# EAGLE schematic SISTEM MINIMUM ATMEGA16 signal (EAGLE 5.06)
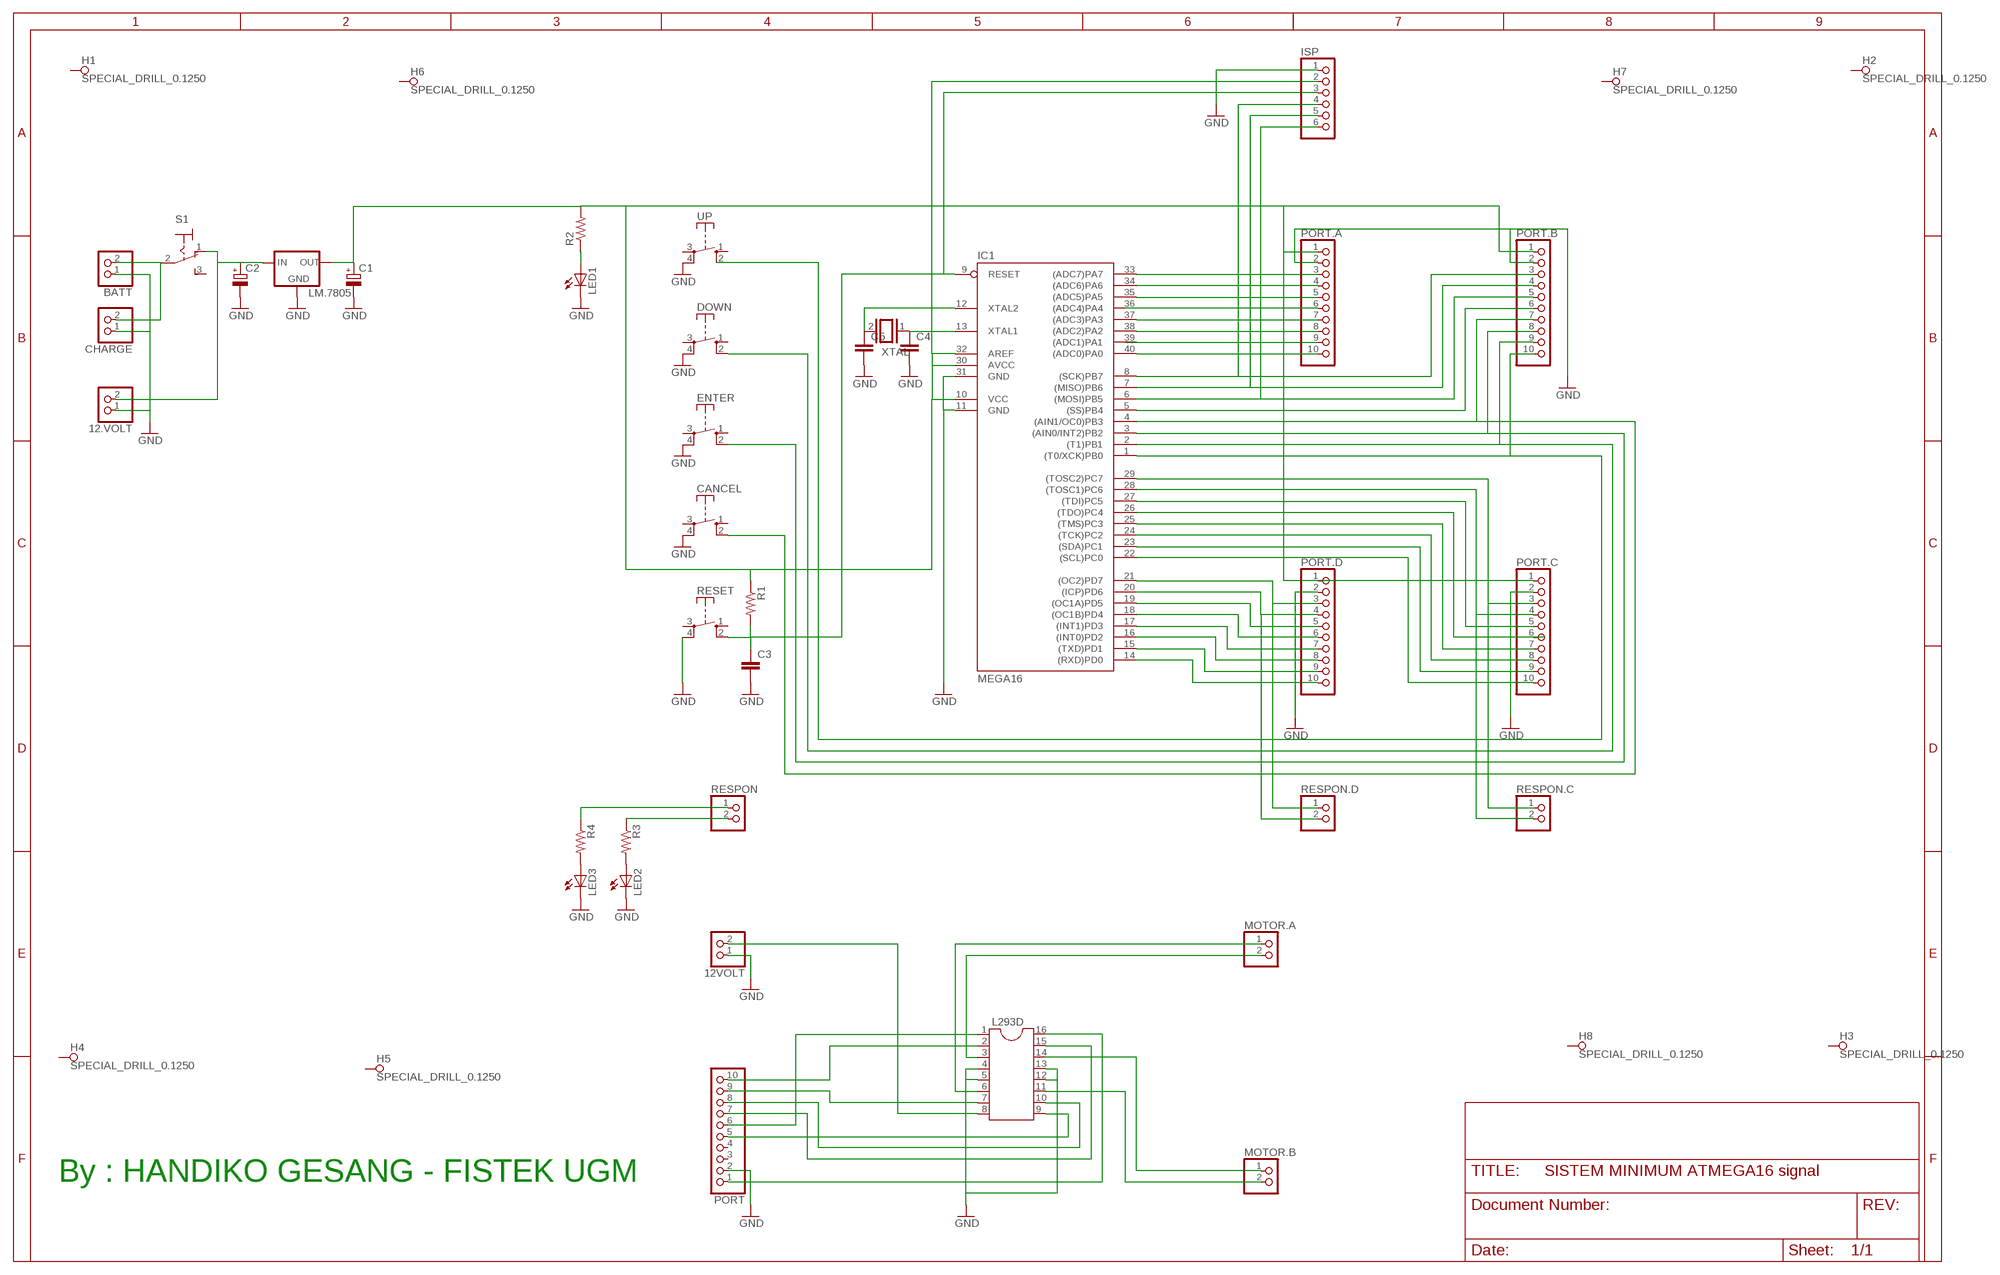
[diagram p0: schematic, sheet 1]

## Parts
12.VOLT  PINHD-1X2  [1X02]
12VOLT  PINHD-1X2  [1X02]
BATT  PINHD-1X2  [1X02]
C1  CPOL-EUB45181B  [B45181B]
C2  CPOL-EUB45181B  [B45181B]
C3  C-EU025-025X050  [C025-025X050]
C4  C-EU025-025X050  [C025-025X050]
C5  C-EU025-025X050  [C025-025X050]
CANCEL  DTE6  [DTE6]
CHARGE  PINHD-1X2  [1X02]
DOWN  DTE6  [DTE6]
ENTER  DTE6  [DTE6]
H1  SPECIAL_DRILL_0.1250  [PAD_0.1250]
H2  SPECIAL_DRILL_0.1250  [PAD_0.1250]
H3  SPECIAL_DRILL_0.1250  [PAD_0.1250]
H4  SPECIAL_DRILL_0.1250  [PAD_0.1250]
H5  SPECIAL_DRILL_0.1250  [PAD_0.1250]
H6  SPECIAL_DRILL_0.1250  [PAD_0.1250]
H7  SPECIAL_DRILL_0.1250  [PAD_0.1250]
H8  SPECIAL_DRILL_0.1250  [PAD_0.1250]
IC1  MEGA16  MEGA16-P  [DIL40]
ISP  PINHD-1X6  [1X06]
L293D  DIL16  [DIL16]
LED1  LED5MM  [LED5MM]
LED2  LED5MM  [LED5MM]
LED3  LED5MM  [LED5MM]
LM.7805  78XXL  [78XXL]
MOTOR.A  PINHD-1X2  [1X02]
MOTOR.B  PINHD-1X2  [1X02]
PORT  PINHD-1X10  [1X10]
PORT.A  PINHD-1X10  [1X10]
PORT.B  PINHD-1X10  [1X10]
PORT.C  PINHD-1X10  [1X10]
PORT.D  PINHD-1X10  [1X10]
R1  R-US_0207/10  [0207/10]
R2  R-US_0207/10  [0207/10]
R3  R-US_0207/10  [0207/10]
R4  R-US_0207/10  [0207/10]
RESET  DTE6  [DTE6]
RESPON  PINHD-1X2  [1X02]
RESPON.C  PINHD-1X2  [1X02]
RESPON.D  PINHD-1X2  [1X02]
S1  320-916  [320-916]
UP  DTE6  [DTE6]
XTAL  XTAL/S  [QS]

## Nets
GND: 12.VOLT.1 12VOLT.1 BATT.1 C1.- C2.- C3.2 C4.2 C5.2 CANCEL.4(P) CHARGE.1 DOWN.4(P) ENTER.4(P) IC1.11(GND) IC1.31(GND) ISP.1 L293D.4 L293D.5 L293D.12 L293D.13 LED1.K(C) LED2.K(C) LED3.K(C) LM.7805.GND PORT.2 PORT.A.2 PORT.B.2 PORT.C.2 PORT.D.2 RESET.4(P) UP.4(P)
N$2: IC1.23((SDA)PC1) PORT.C.9
N$3: 12.VOLT.2 C2.+ LM.7805.IN S1.1(O)
N$4: BATT.2 CHARGE.2 S1.2(P)
N$5: DOWN.2(S) IC1.2((T1)PB1) PORT.B.9
N$6: LED1.A R2.1
N$7: C4.1 IC1.13(XTAL1) XTAL.1
N$8: C5.1 IC1.12(XTAL2) XTAL.2
N$9: C3.1 IC1.9(RESET) ISP.3 R1.2 RESET.2(S)
N$10: IC1.24((TCK)PC2) PORT.C.8
N$11: IC1.22((SCL)PC0) PORT.C.10
N$12: IC1.40((ADC0)PA0) PORT.A.10
N$13: PORT.A.9
N$14: IC1.38((ADC2)PA2) PORT.A.8
N$15: IC1.37((ADC3)PA3) PORT.A.7
N$16: PORT.A.6
N$17: IC1.35((ADC5)PA5) PORT.A.5
N$18: IC1.34((ADC6)PA6) PORT.A.4
N$19: IC1.33((ADC7)PA7) PORT.A.3
N$20: IC1.1((T0/XCK)PB0) PORT.B.10 UP.2(S)
N$21: L293D.6 MOTOR.A.1
N$22: L293D.3 MOTOR.A.2
N$23: L293D.11 MOTOR.B.2
N$24: IC1.5((SS)PB4) PORT.B.6
N$25: IC1.7((MISO)PB6) ISP.5 PORT.B.4
N$26: IC1.8((SCK)PB7) ISP.4 PORT.B.3
N$27: IC1.6((MOSI)PB5) ISP.6 PORT.B.5
N$28: IC1.29((TOSC2)PC7) PORT.C.3 RESPON.C.1
N$29: IC1.28((TOSC1)PC6) PORT.C.4 RESPON.C.2
N$30: IC1.27((TDI)PC5) PORT.C.5
N$31: IC1.26((TDO)PC4) PORT.C.6
N$32: CANCEL.2(S) IC1.4((AIN1/OC0)PB3) PORT.B.7
N$33: IC1.25((TMS)PC3) PORT.C.7
N$34: L293D.14 MOTOR.B.1
N$35: L293D.1 PORT.6
N$36: IC1.21((OC2)PD7) PORT.D.3 RESPON.D.1
N$37: IC1.20((ICP)PD6) PORT.D.4 RESPON.D.2
N$38: IC1.19((OC1A)PD5) PORT.D.5
N$39: IC1.18((OC1B)PD4) PORT.D.6
N$40: IC1.17((INT1)PD3) PORT.D.7
N$41: IC1.16((INT0)PD2) PORT.D.8
N$42: IC1.15((TXD)PD1) PORT.D.9
N$43: IC1.14((RXD)PD0) PORT.D.10
N$44: L293D.9 PORT.5
N$45: ENTER.2(S) IC1.3((AIN0/INT2)PB2) PORT.B.8
N$46: LED2.A R3.2
N$47: L293D.2 PORT.10
N$48: L293D.7 PORT.9
N$49: L293D.10 PORT.8
N$50: L293D.15 PORT.7
N$51: L293D.16 PORT.1
N$52: 12VOLT.2 L293D.8
N$53: LED3.A R4.2
N$54: R3.1 RESPON.2
N$55: R4.1 RESPON.1
UP: C1.+ IC1.10(VCC) IC1.30(AVCC) IC1.32(AREF) ISP.2 LM.7805.OUT PORT.A.1 PORT.B.1 PORT.C.1 PORT.D.1 R1.1 R2.2
Unconnected: CANCEL.1(S) CANCEL.3(P) DOWN.1(S) DOWN.3(P) ENTER.1(S) ENTER.3(P) H1.1 H2.1 H3.1 H4.1 H5.1 H6.1 H7.1 H8.1 IC1.36((ADC4)PA4) IC1.39((ADC1)PA1) PORT.3 PORT.4 RESET.1(S) RESET.3(P) S1.3(S) UP.1(S) UP.3(P)

## Notes on the sheet
- By : HANDIKO GESANG - FISTEK UGM

## Library data of the parts
12.VOLT 12VOLT BATT CHARGE MOTOR.A MOTOR.B RESPON RESPON.C RESPON.D = pinhead:PINHD-1X2: PIN HEADER
C1 C2 = resistor:CPOL-EU: POLARIZED CAPACITOR, European symbol
C3-C5 = resistor:C-EU: CAPACITOR, European symbol
CANCEL DOWN ENTER RESET UP = switch-misc:DT: ITT SWITCH
H1-H8 = special-drill:SPECIAL_DRILL_: Special drills
IC1 = atmel:MEGA16-P: MICROCONTROLLER 16 Kbytes FLASH 1 kbytes SRAM 512 bytes EEPROM USART 8-channel 10 bit ADC Source: avr.lbr
ISP = pinhead:PINHD-1X6: PIN HEADER
L293D = ic-package:DIL16: Dual In Line / Socket
LED1-LED3 = led:LED: LED OSRAM: - CHIPLED LG R971, LG N971, LY N971, LG Q971, LY Q971, LO R971, LY R971 LH N974, LH R974 LS Q976, LO Q976, LY Q976 LO Q996 - Hyper CHIPLED LW Q18S LB Q993, LB Q99A, LB R99A - SideLED LS A670, LO A670, LY A670, LG A670, LP A670 LB A673, LV A673, LT A673, LW A673 LH A674 LY A675 LS A676, LA A676, LO A676, LY A676, LW A676 LS A679, LY A679, LG A679 - Hyper Micro SIDELED® LS Y876, LA Y876, LO Y876, LY Y876 LT Y87S - SmartLED LW L88C, LW L88S LB L89C, LB L89S, LG L890 LS L89K, LO L89K, LY L89K LS L896, LA L896, LO L896, LY L896 - TOPLED LS T670, LO T670, LY T670, LG T670, LP T670 LSG T670, LSP T670, LSY T670, LOP T670, LYG T670 LG T671, LOG T671, LSG T671 LB T673, LV T673, LT T673, LW T673 LH T674 LS T676, LA T676, LO T676, LY T676, LB T676, LH T676, LSB T676, LW T676 LB T67C, LV T67C, LT T67C, LS T67K, LO T67K, LY T67K, LW E67C LS E67B, LA E67B, LO E67B, LY E67B, LB E67C, LV E67C, LT E67C LW T67C LS T679, LY T679, LG T679 LS T770, LO T770, LY T770, LG T770, LP T770 LB T773, LV T773, LT T773, LW T773 LH T774 LS E675, LA E675, LY E675, LS T675 LS T776, LA T776, LO T776, LY T776, LB T776 LHGB T686 LT T68C, LB T68C - Hyper Mini TOPLED® LB M676 - Mini TOPLED Santana® LG M470 LS M47K, LO M47K, LY M47K Source: http://www.osram.convergy.de LUXEON: - LUMILED® LXK2-PW12-R00, LXK2-PW12-S00, LXK2-PW14-U00, LXK2-PW14-V00 LXK2-PM12-R00, LXK2-PM12-S00, LXK2-PM14-U00 LXK2-PE12-Q00, LXK2-PE12-R00, LXK2-PE12-S00, LXK2-PE14-T00, LXK2-PE14-U00 LXK2-PB12-K00, LXK2-PB12-L00, LXK2-PB12-M00, LXK2-PB14-N00, LXK2-PB14-P00, LXK2-PB14-Q00 LXK2-PR12-L00, LXK2-PR12-M00, LXK2-PR14-Q00, LXK2-PR14-R00 LXK2-PD12-Q00, LXK2-PD12-R00, LXK2-PD12-S00 LXK2-PH12-R00, LXK2-PH12-S00 LXK2-PL12-P00, LXK2-PL12-Q00, LXK2-PL12-R00 Source: www.luxeon.com KINGBRIGHT: KA-3528ASYC Source: www.kingbright.com
LM.7805 = v-reg:78XXL: VOLTAGE REGULATOR
PORT PORT.A PORT.B PORT.C PORT.D = pinhead:PINHD-1X10: PIN HEADER
R1-R4 = resistor:R-US_: RESISTOR, American symbol
S1 = switch:320-916: TOGGLE SWITCH distributor RS Components
XTAL = special:XTAL/S: CRYSTAL